# Altium schematic sheet 0186.SchDoc
size 848 x 558 mm
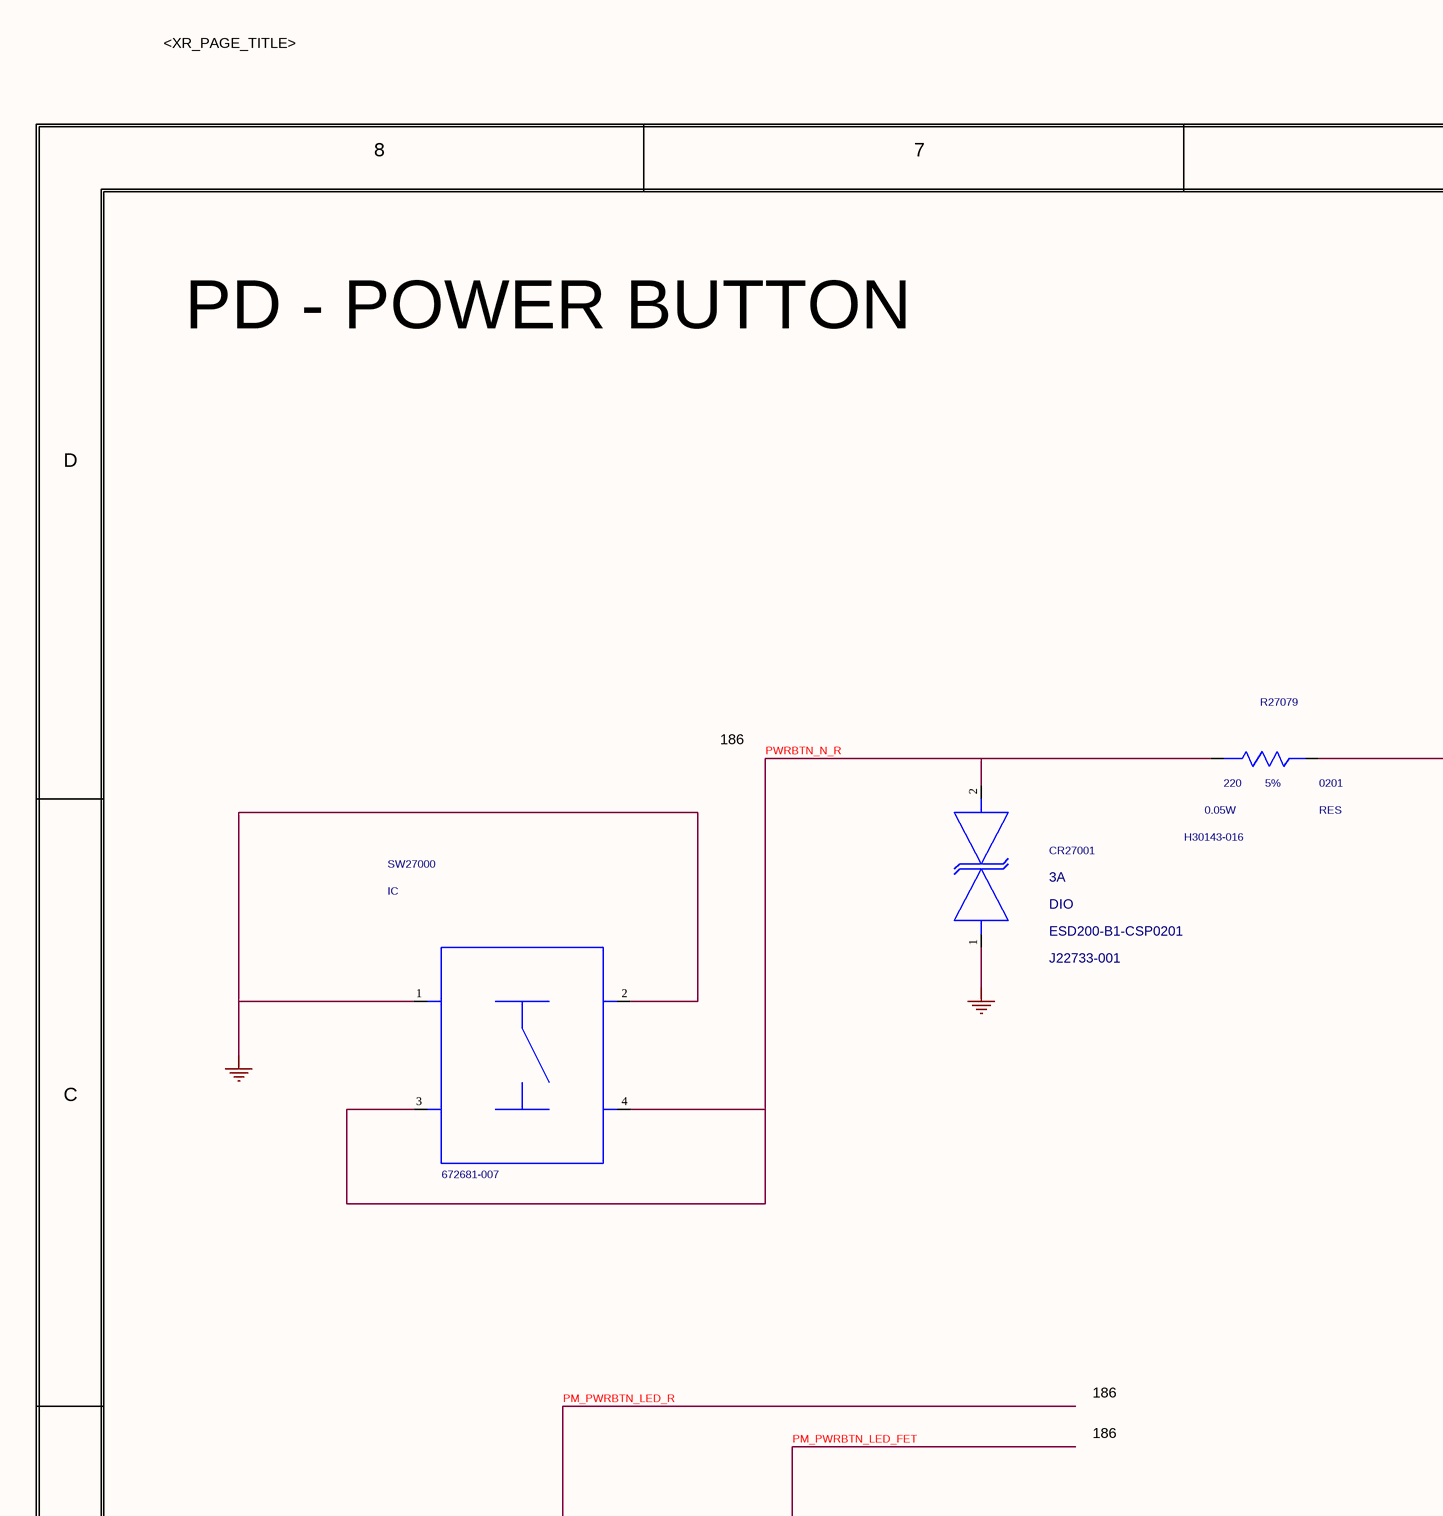
[diagram p0: 0186.SchDoc, top left]
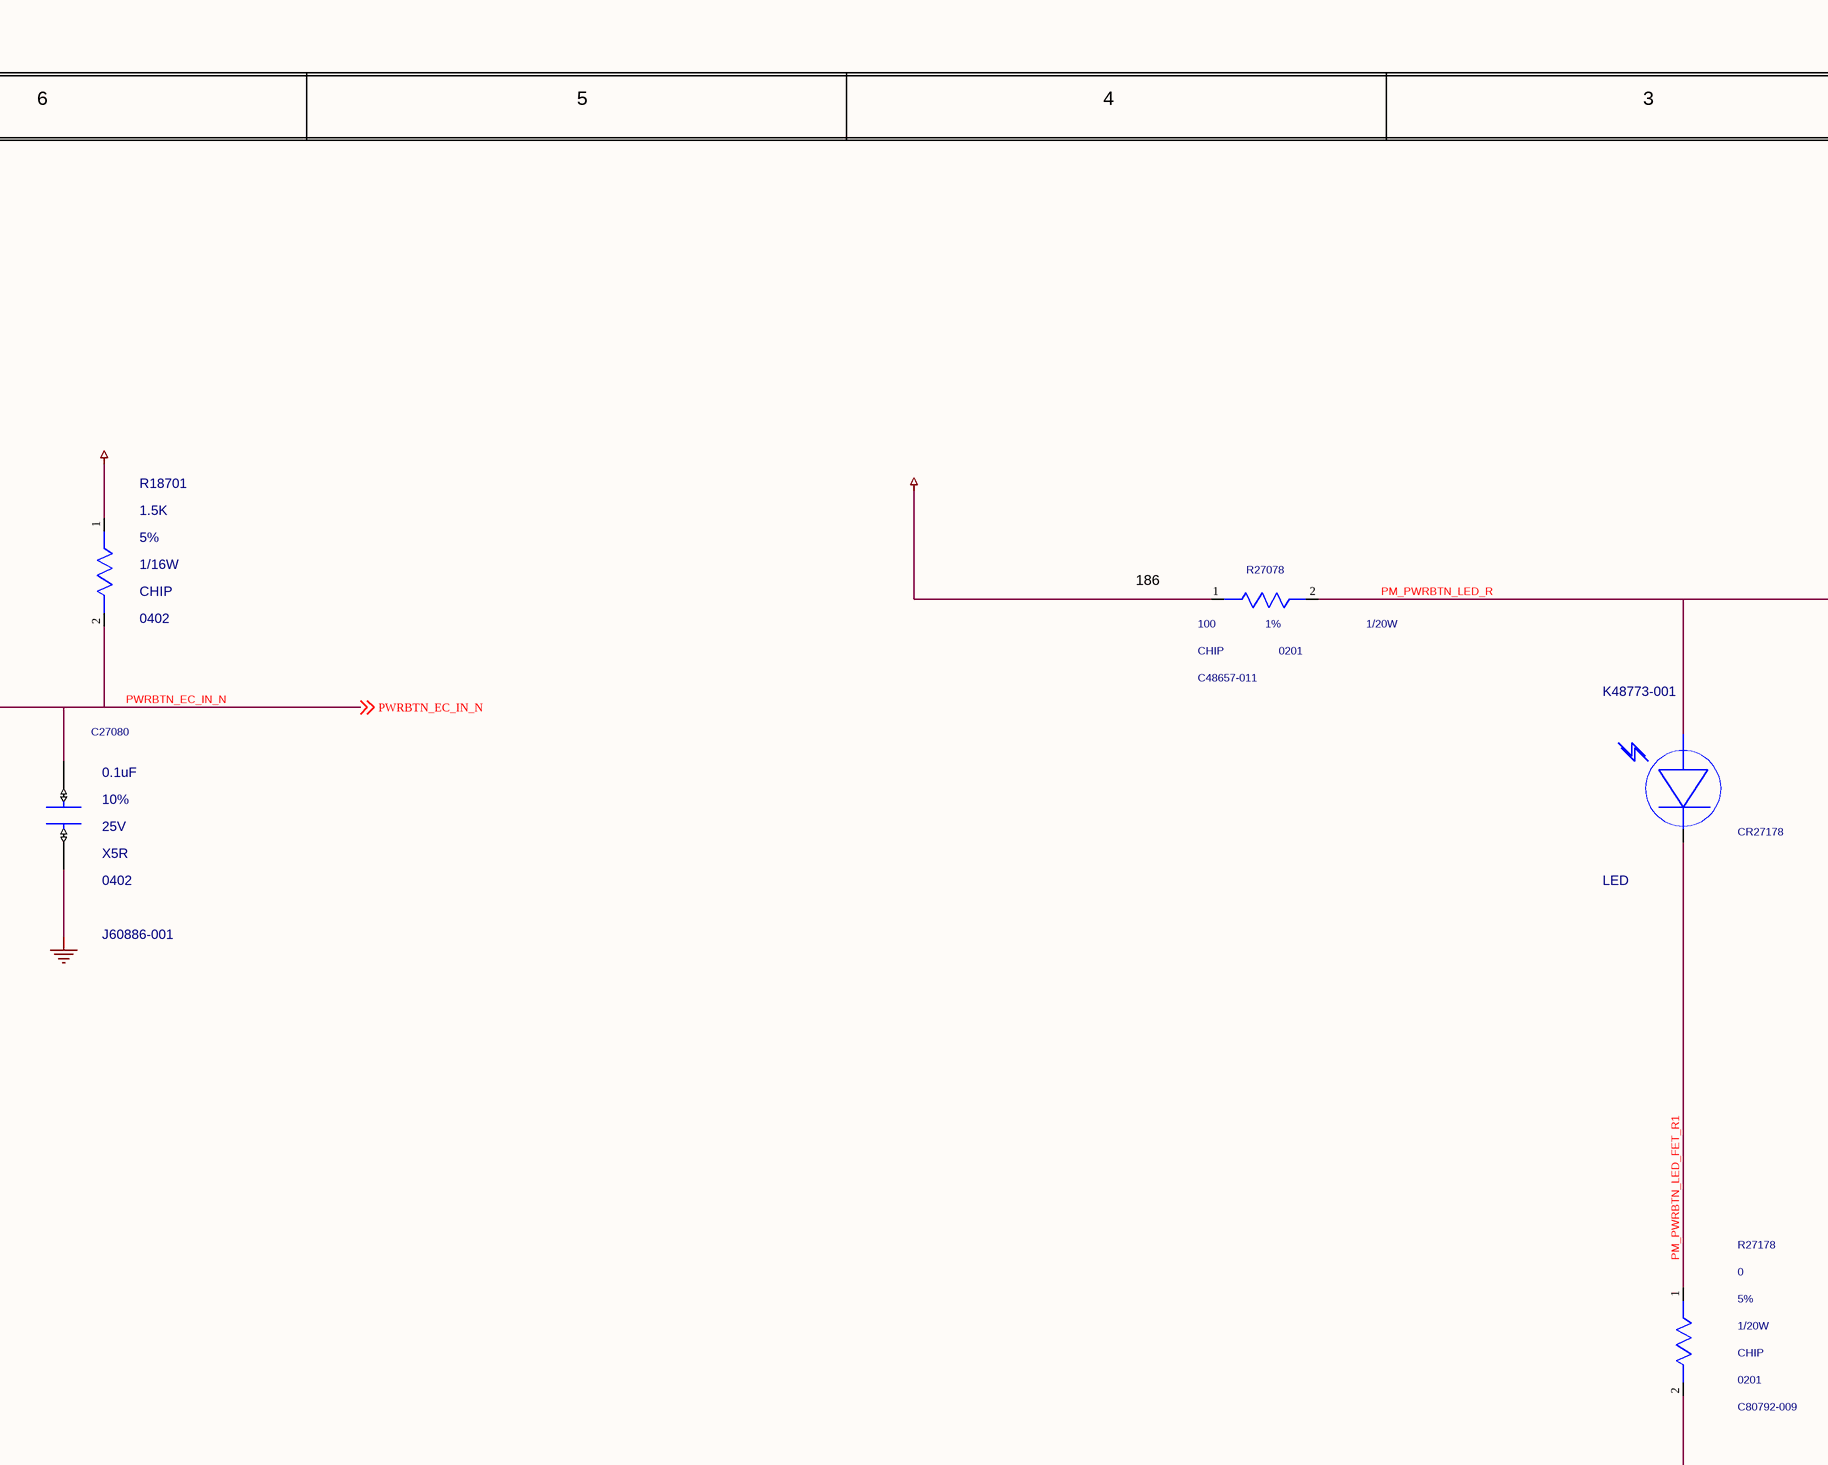
[diagram p1: 0186.SchDoc, top middle]
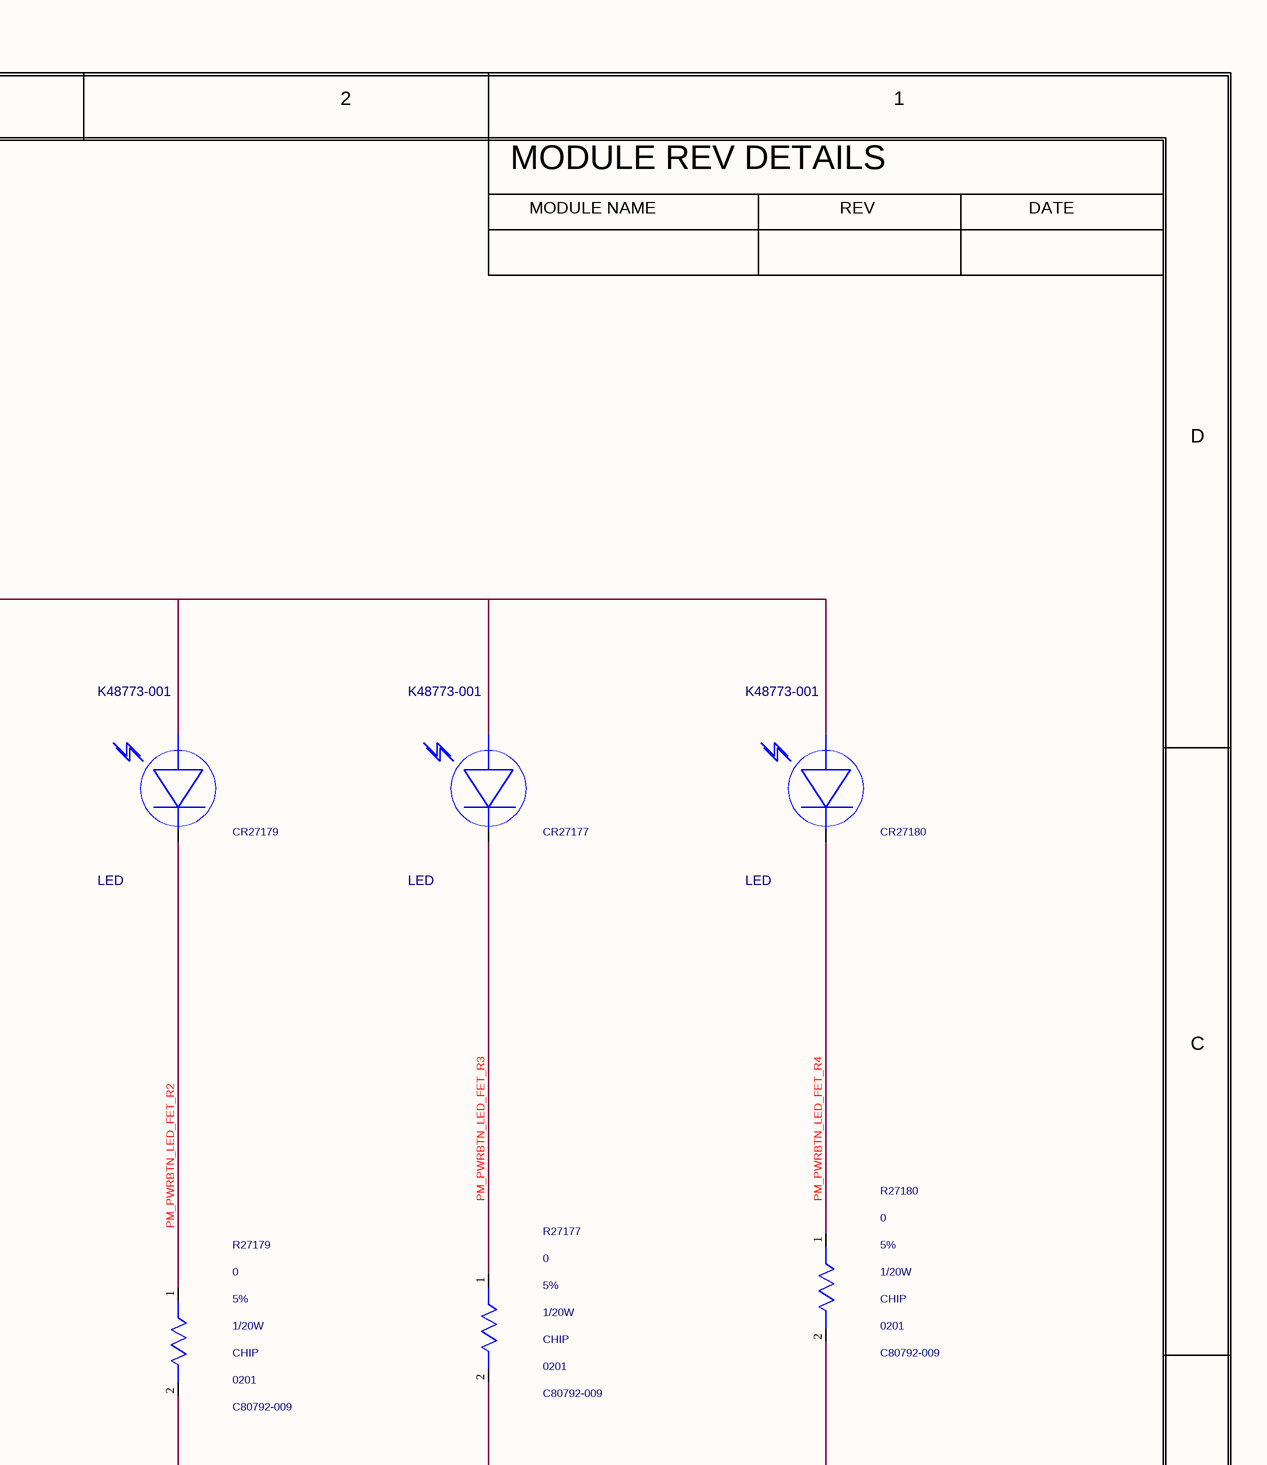
[diagram p2: 0186.SchDoc, top right]
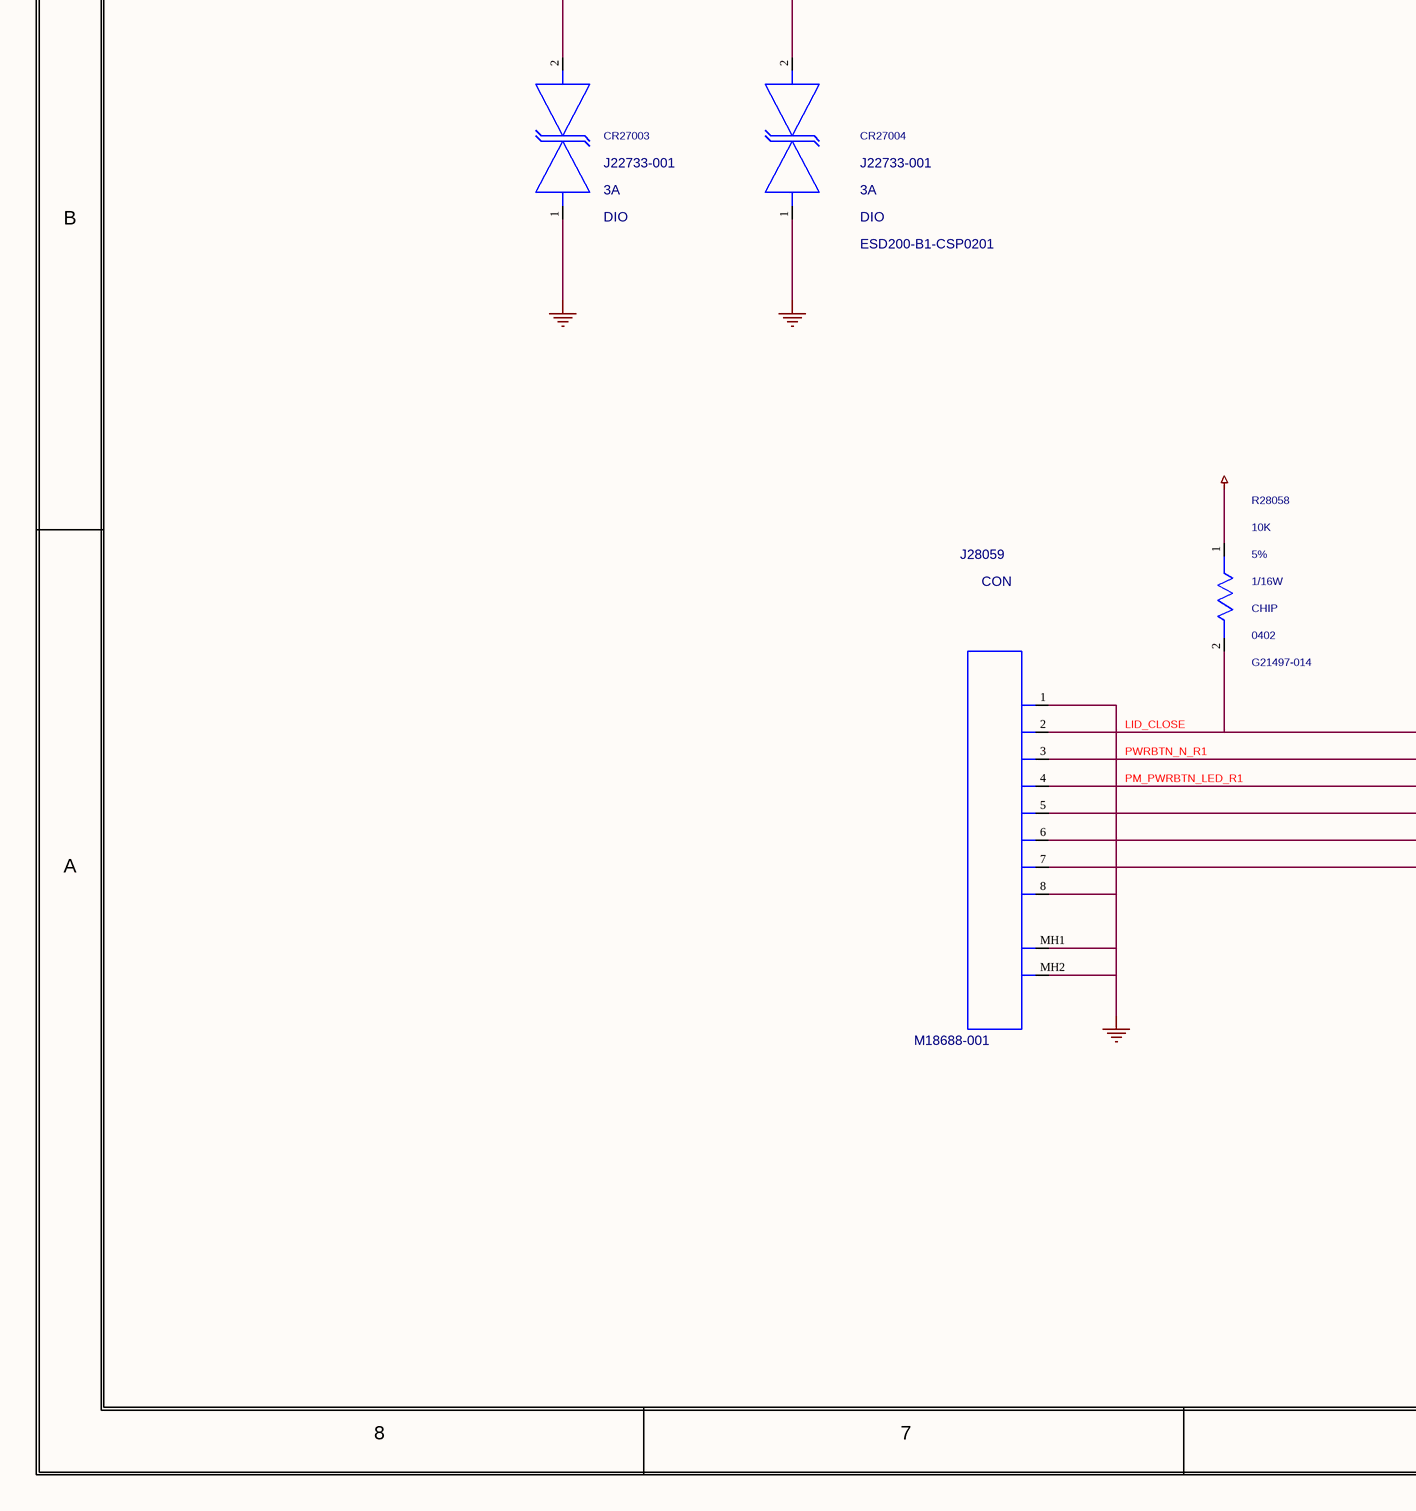
[diagram p3: 0186.SchDoc, bottom left]
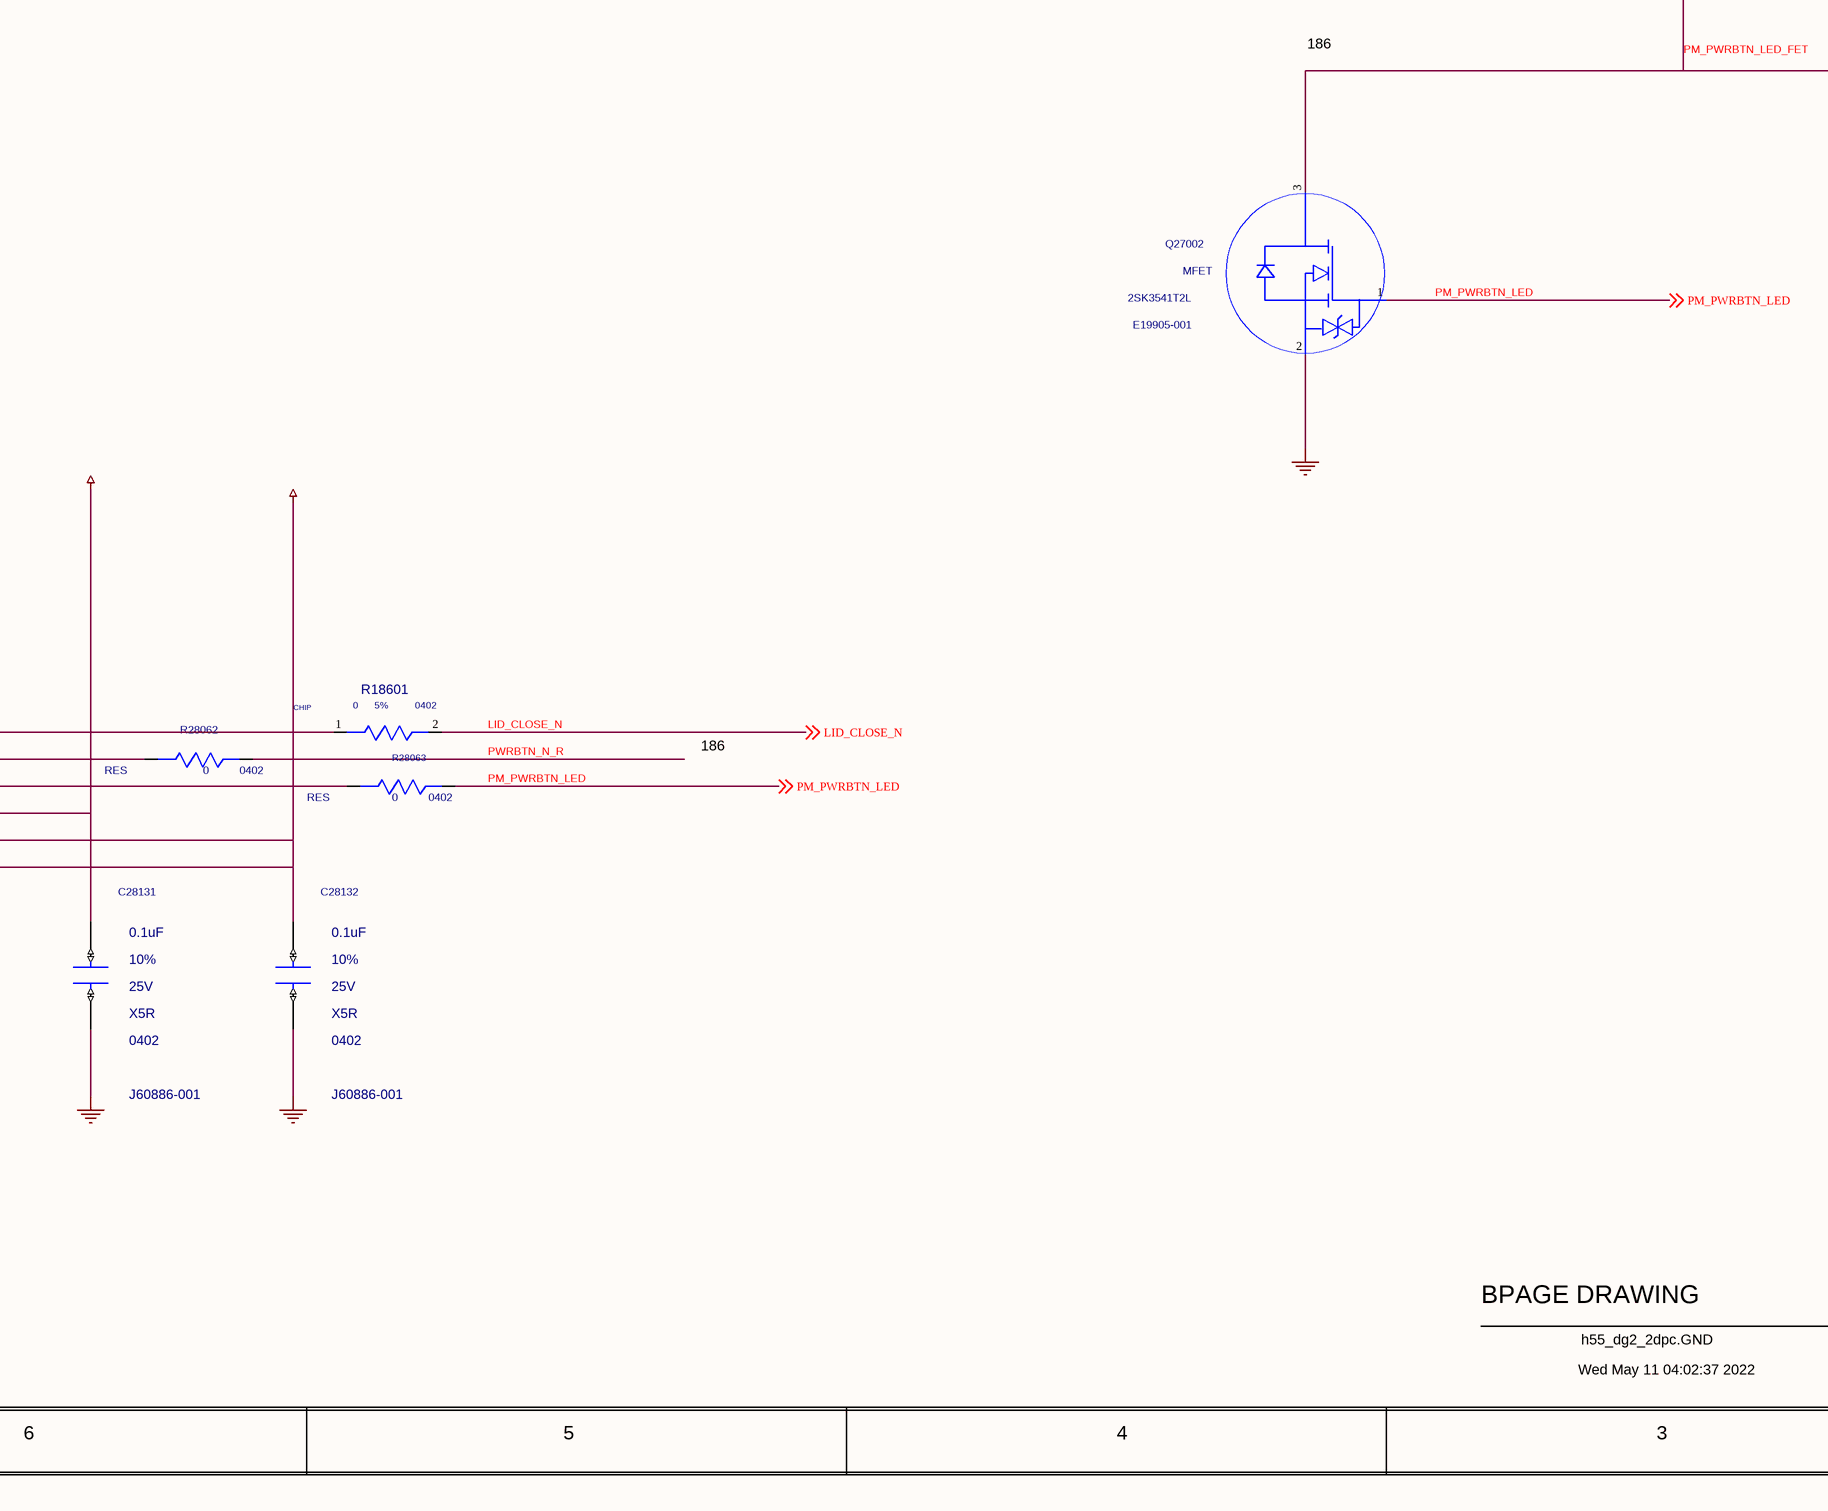
[diagram p4: 0186.SchDoc, bottom middle]
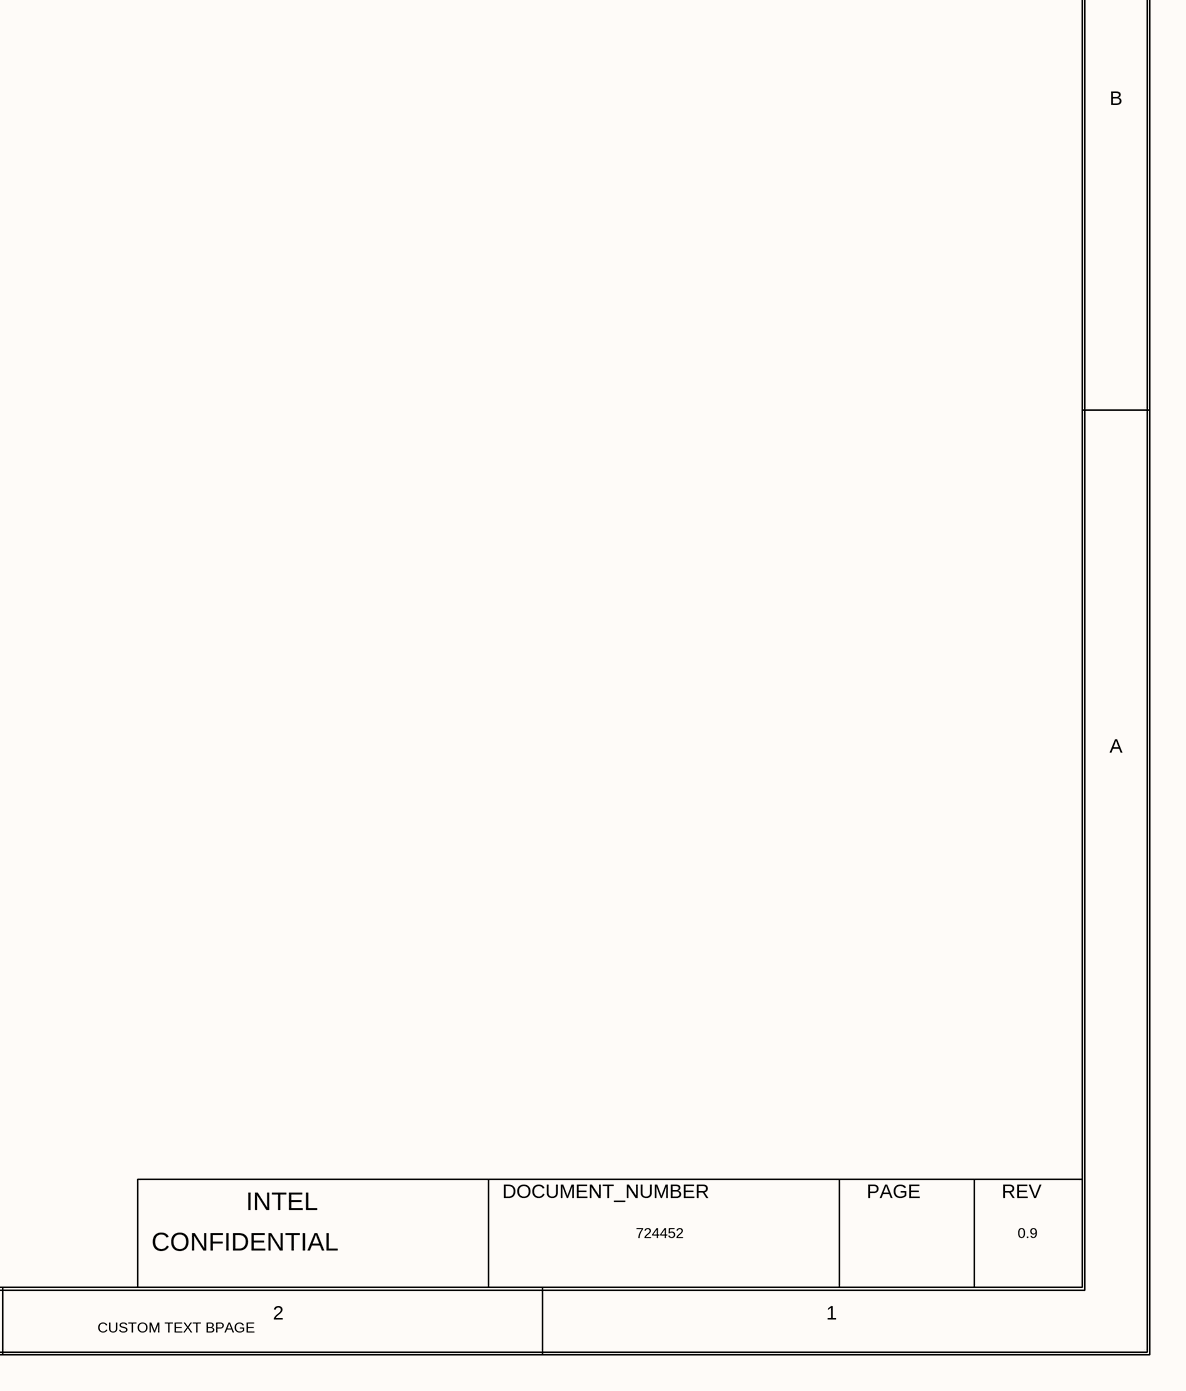
[diagram p5: 0186.SchDoc, bottom right]

## Parts
C27080  0.1uF  MATERIAL: X5R  PACK_TYPE: 0402  PART_NUMBER: J60886-001  TOLERANCE: 10%  VOLTAGE: 25V  [TK0_SM0402_1050X550_MB]
C28131  0.1uF  MATERIAL: X5R  PACK_TYPE: 0402  PART_NUMBER: J60886-001  TOLERANCE: 10%  VOLTAGE: 25V  [TK0_SM0402_1050X550_MB]
C28132  0.1uF  MATERIAL: X5R  PACK_TYPE: 0402  PART_NUMBER: J60886-001  TOLERANCE: 10%  VOLTAGE: 25V  [TK0_SM0402_1050X550_MB]
CR27001  ESD200-B1-CSP0201  CURRENT: 3A  MATERIAL: DIO  PART_NUMBER: J22733-001  [TK1_SCR0201_610X310_MB]
CR27003  CURRENT: 3A  MATERIAL: DIO  PART_NUMBER: J22733-001  [TK1_SCR0201_610X310_MB]  (hidden comment: ESD200-B1-CSP0201)
CR27004  ESD200-B1-CSP0201  CURRENT: 3A  MATERIAL: DIO  PART_NUMBER: J22733-001  [TK1_SCR0201_610X310_MB]
CR27177  MATERIAL: LED  PART_NUMBER: K48773-001  [TK2_SLED0402_1100X600_MA]  (hidden comment: LED_2)
CR27178  MATERIAL: LED  PART_NUMBER: K48773-001  [TK2_SLED0402_1100X600_MA]  (hidden comment: LED_2)
CR27179  MATERIAL: LED  PART_NUMBER: K48773-001  [TK2_SLED0402_1100X600_MA]  (hidden comment: LED_2)
CR27180  MATERIAL: LED  PART_NUMBER: K48773-001  [TK2_SLED0402_1100X600_MA]  (hidden comment: LED_2)
J28059  MATERIAL: CON  PART_NUMBER: M18688-001  [CTK0_B2B_SJR_1X8_2EM_500_MA_VR]  (hidden comment: C_B2B_1X8_2EM)
Q27002  2SK3541T2L  MATERIAL: MFET  PART_NUMBER: E19905-001  [CTK0_SOT723_900X1300_400_MA]
R18601  0  MATERIAL: CHIP  PACK_TYPE: 0402  TOLERANCE: 5%  [SMR0402IA]
R18701  1.5K  MATERIAL: CHIP  PACK_TYPE: 0402  TOLERANCE: 5%  WATTAGE: 1/16W  [SMR0402IA]
R27078  100  MATERIAL: CHIP  PACK_TYPE: 0201  PART_NUMBER: C48657-011  TOLERANCE: 1%  WATTAGE: 1/20W  [SMR0201IA]
R27079  220  MATERIAL: RES  PACK_TYPE: 0201  PART_NUMBER: H30143-016  TOLERANCE: 5%  WATTAGE: 0.05W  [CTK0_SM0201_630X330_MA]
R27177  0  MATERIAL: CHIP  PACK_TYPE: 0201  PART_NUMBER: C80792-009  TOLERANCE: 5%  WATTAGE: 1/20W  [SMR0201IA]
R27178  0  MATERIAL: CHIP  PACK_TYPE: 0201  PART_NUMBER: C80792-009  TOLERANCE: 5%  WATTAGE: 1/20W  [SMR0201IA]
R27179  0  MATERIAL: CHIP  PACK_TYPE: 0201  PART_NUMBER: C80792-009  TOLERANCE: 5%  WATTAGE: 1/20W  [SMR0201IA]
R27180  0  MATERIAL: CHIP  PACK_TYPE: 0201  PART_NUMBER: C80792-009  TOLERANCE: 5%  WATTAGE: 1/20W  [SMR0201IA]
R28058  10K  MATERIAL: CHIP  PACK_TYPE: 0402  PART_NUMBER: G21497-014  TOLERANCE: 5%  WATTAGE: 1/16W  [SMR0402IA]
R28062  0  MATERIAL: RES  PACK_TYPE: 0402  [CTK0_SM0402_1100X550_MA]
R28063  0  MATERIAL: RES  PACK_TYPE: 0402  [CTK0_SM0402_1100X550_MA]
SW27000  MATERIAL: IC  PART_NUMBER: 672681-007  [CTK0_SSW4_VPS5200_3700_MA_VR]  (hidden comment: C_SW_SPST_PB_4P)

## Nets
+V3P3A_KBC: C28131.1(A) J28059.5(IO5) R27078.1(A)
+V5A_L: C28132.1(A) J28059.6(IO6) J28059.7(IO7)
+V_EC_VBAT: R18701.1(A)
+VREG3P3_DSW: R28058.1(A)
GND: C27080.2(B) C28131.2(B) C28132.2(B) CR27001.1(A1) CR27003.1(A1) CR27004.1(A1) J28059.1(IO1) J28059.8(IO8) J28059.MH1 J28059.MH2 Q27002.2(S) SW27000.1 SW27000.2
LID_CLOSE: J28059.2(IO2) R18601.1(A) R28058.2(B)
LID_CLOSE_N: R18601.2(B) ; off-sheet LID_CLOSE_N
PM_PWRBTN_LED: Q27002.1(G) R28063.2(B) ; off-sheet PM_PWRBTN_LED
PM_PWRBTN_LED_FET: CR27004.2(A2) Q27002.3(D) R27177.2(B) R27178.2(B) R27179.2(B) R27180.2(B)
PM_PWRBTN_LED_FET_R1: CR27178.2(C) R27178.1(A)
PM_PWRBTN_LED_FET_R2: CR27179.2(C) R27179.1(A)
PM_PWRBTN_LED_FET_R3: CR27177.2(C) R27177.1(A)
PM_PWRBTN_LED_FET_R4: CR27180.2(C) R27180.1(A)
PM_PWRBTN_LED_R: CR27003.2(A2) CR27177.1(A) CR27178.1(A) CR27179.1(A) CR27180.1(A) R27078.2(B)
PM_PWRBTN_LED_R1: J28059.4(IO4) R28063.1(A)
PWRBTN_EC_IN_N: C27080.1(A) R18701.2(B) R27079.2(B) ; off-sheet PWRBTN_EC_IN_N
PWRBTN_N_R: CR27001.2(A2) R27079.1(A) R28062.2(B) SW27000.3 SW27000.4
PWRBTN_N_R1: J28059.3(IO3) R28062.1(A)

## Notes on the sheet
- <XR_PAGE_TITLE>
- 8
- 7
- 6
- 5
- 4
- 3
- 2
- 1
- MODULE REV DETAILS
- MODULE NAME
- REV
- DATE
- PD - POWER BUTTON
- D
- 186
- C
- B
- A
- BPAGE DRAWING
- INTEL
- DOCUMENT_NUMBER
- PAGE
- Wed May 11 04:02:37 2022
- h55_dg2_2dpc.GND
- CONFIDENTIAL
- 724452
- 0.9
- CUSTOM TEXT BPAGE

## Library data of the parts
C27080 = CAP_2: CDS_PHYS_PART_NAME: CAP_2_0402-J60886-001,X5R,0.1UF,25V,10%,TK0,GENERIC; BOM_USE: STUFF; CDS_LMAN_SYM_OUTLINE: -50,50,50,-50; FP_TECH: TK0; IP: GENERIC; ROOM: NONE; OriginalSymbolOrigin: (-50,25); XY: (-8850,1075); VER: 1; SUB_ROOM_2: MISC; SUB_ROOM_1: BUTTONS; SUB_ROOM: DECOUPLING; ROT: 0; PHYS_PAGE: 186; LOCATION: C27080; DRAWING: @RVP1_ADL_SB_ADP_S_DDR5_SODIMM_2DPC_LIB.H55_DG2_2DPC(SCH_1):PAGE555; CDS_LIB: discrete_2; VARIANT: ?; PCB Footprint: TK0_SM0402_1050X550_MB; CHIPS_PART_NAME: CAP_2; CDS_PART_NAME: CAP_2_0402-J60886-001,X5R,0.1UF,25V,10%,TK0,GENERIC; CDS_LOCATION: C27080
C28131 = CAP_2: CDS_PHYS_PART_NAME: CAP_2_0402-J60886-001,X5R,0.1UF,25V,10%,TK0,GENERIC; BOM_USE: STUFF; CDS_LMAN_SYM_OUTLINE: -50,50,50,-50; FP_TECH: TK0; IP: GENERIC; ROOM: NONE; OriginalSymbolOrigin: (-50,25); XY: (-8800,-1875); VER: 1; SUB_ROOM_2: MISC; SUB_ROOM_1: BUTTONS; SUB_ROOM: DECOUPLING; ROT: 0; PHYS_PAGE: 186; LOCATION: C28131; DRAWING: @RVP1_ADL_SB_ADP_S_DDR5_SODIMM_2DPC_LIB.H55_DG2_2DPC(SCH_1):PAGE555; CDS_LIB: discrete_2; VARIANT: ?; PCB Footprint: TK0_SM0402_1050X550_MB; CHIPS_PART_NAME: CAP_2; CDS_PART_NAME: CAP_2_0402-J60886-001,X5R,0.1UF,25V,10%,TK0,GENERIC; CDS_LOCATION: C28131
C28132 = CAP_2: CDS_PHYS_PART_NAME: CAP_2_0402-J60886-001,X5R,0.1UF,25V,10%,TK0,GENERIC; BOM_USE: STUFF; CDS_LMAN_SYM_OUTLINE: -50,50,50,-50; FP_TECH: TK0; IP: GENERIC; ROOM: NONE; OriginalSymbolOrigin: (-50,25); XY: (-8425,-1875); VER: 1; SUB_ROOM_2: MISC; SUB_ROOM_1: BUTTONS; SUB_ROOM: DECOUPLING; ROT: 0; PHYS_PAGE: 186; LOCATION: C28132; DRAWING: @RVP1_ADL_SB_ADP_S_DDR5_SODIMM_2DPC_LIB.H55_DG2_2DPC(SCH_1):PAGE555; CDS_LIB: discrete_2; VARIANT: ?; PCB Footprint: TK0_SM0402_1050X550_MB; CHIPS_PART_NAME: CAP_2; CDS_PART_NAME: CAP_2_0402-J60886-001,X5R,0.1UF,25V,10%,TK0,GENERIC; CDS_LOCATION: C28132
CR27001 = DIODE_TVS_2: CDS_PHYS_PART_NAME: DIODE_TVS_2_SM-J22733-001,DIO,ESD200-B1-CSP0201,3A,TK1,GENERIC; BOM_USE: STUFF; CDS_LMAN_SYM_OUTLINE: -100,50,100,-50; FP_TECH: TK1; IP: GENERIC; PACK_TYPE: SM; ROOM: NONE; OriginalSymbolOrigin: (-125,50); XY: (-9775,1075); VER: 1; SUB_ROOM_2: EMI_ESD_FILTER; SUB_ROOM_1: BUTTONS; SUB_ROOM: ESD; PHYS_PAGE: 186; LOCATION: CR27001; DRAWING: @RVP1_ADL_SB_ADP_S_DDR5_SODIMM_2DPC_LIB.H55_DG2_2DPC(SCH_1):PAGE555; CDS_LIB: discrete_2; VARIANT: ?; PCB Footprint: TK1_SCR0201_610X310_MB; ROT: 1; CHIPS_PART_NAME: DIODE_TVS_2; CDS_PART_NAME: DIODE_TVS_2_SM-J22733-001,DIO,ESD200-B1-CSP0201,3A,TK1,GENERIC; CDS_LOCATION: CR27001
CR27003 = DIODE_TVS_2: CDS_PHYS_PART_NAME: DIODE_TVS_2_SM-J22733-001,DIO,ESD200-B1-CSP0201,3A,TK1,GENERIC; BOM_USE: STUFF; CDS_LMAN_SYM_OUTLINE: -100,50,100,-50; FP_TECH: TK1; IP: GENERIC; PACK_TYPE: SM; ROOM: NONE; OriginalSymbolOrigin: (-125,50); XY: (-10550,-325); VER: 1; SUB_ROOM_2: EMI_ESD_FILTER; SUB_ROOM_1: BUTTONS; SUB_ROOM: ESD; ROT: 7; PHYS_PAGE: 186; LOCATION: CR27003; DRAWING: @RVP1_ADL_SB_ADP_S_DDR5_SODIMM_2DPC_LIB.H55_DG2_2DPC(SCH_1):PAGE555; CDS_LIB: discrete_2; VARIANT: ?; PCB Footprint: TK1_SCR0201_610X310_MB; CHIPS_PART_NAME: DIODE_TVS_2; CDS_PART_NAME: DIODE_TVS_2_SM-J22733-001,DIO,ESD200-B1-CSP0201,3A,TK1,GENERIC; CDS_LOCATION: CR27003
CR27004 = DIODE_TVS_2: CDS_PHYS_PART_NAME: DIODE_TVS_2_SM-J22733-001,DIO,ESD200-B1-CSP0201,3A,TK1,GENERIC; BOM_USE: STUFF; CDS_LMAN_SYM_OUTLINE: -100,50,100,-50; FP_TECH: TK1; IP: GENERIC; PACK_TYPE: SM; ROOM: NONE; OriginalSymbolOrigin: (-125,50); XY: (-10125,-325); VER: 1; SUB_ROOM_2: EMI_ESD_FILTER; SUB_ROOM_1: BUTTONS; SUB_ROOM: ESD; ROT: 7; PHYS_PAGE: 186; LOCATION: CR27004; DRAWING: @RVP1_ADL_SB_ADP_S_DDR5_SODIMM_2DPC_LIB.H55_DG2_2DPC(SCH_1):PAGE555; CDS_LIB: discrete_2; VARIANT: ?; PCB Footprint: TK1_SCR0201_610X310_MB; CHIPS_PART_NAME: DIODE_TVS_2; CDS_PART_NAME: DIODE_TVS_2_SM-J22733-001,DIO,ESD200-B1-CSP0201,3A,TK1,GENERIC; CDS_LOCATION: CR27004
CR27177 = LED_2: CDS_PHYS_PART_NAME: LED_2_A1-K48773-001,LED,WHITE,TK2,GENERIC; BOM_USE: STUFF; CDS_LMAN_SYM_OUTLINE: -150,100,100,-100; FP_TECH: TK2; IP: GENERIC; PACK_TYPE: A1; ROOM: NONE; OriginalSymbolOrigin: (-125,75); XY: (-4650,1125); VER: 4; ROT: 6; PHYS_PAGE: 186; LOCATION: CR27177; DRAWING: @RVP1_ADL_SB_ADP_S_DDR5_SODIMM_2DPC_LIB.H55_DG2_2DPC(SCH_1):PAGE555; CDS_LIB: discrete_2; VARIANT: ?; PCB Footprint: TK2_SLED0402_1100X600_MA; CHIPS_PART_NAME: LED_2; CDS_PART_NAME: LED_2_A1-K48773-001,LED,WHITE,TK2,GENERIC; CDS_LOCATION: CR27177
CR27178 = LED_2: CDS_PHYS_PART_NAME: LED_2_A1-K48773-001,LED,WHITE,TK2,GENERIC; BOM_USE: STUFF; CDS_LMAN_SYM_OUTLINE: -150,100,100,-100; FP_TECH: TK2; IP: GENERIC; PACK_TYPE: A1; ROOM: NONE; OriginalSymbolOrigin: (-125,75); XY: (-5850,1125); VER: 4; ROT: 6; PHYS_PAGE: 186; LOCATION: CR27178; DRAWING: @RVP1_ADL_SB_ADP_S_DDR5_SODIMM_2DPC_LIB.H55_DG2_2DPC(SCH_1):PAGE555; CDS_LIB: discrete_2; VARIANT: ?; PCB Footprint: TK2_SLED0402_1100X600_MA; CHIPS_PART_NAME: LED_2; CDS_PART_NAME: LED_2_A1-K48773-001,LED,WHITE,TK2,GENERIC; CDS_LOCATION: CR27178
CR27179 = LED_2: CDS_PHYS_PART_NAME: LED_2_A1-K48773-001,LED,WHITE,TK2,GENERIC; BOM_USE: STUFF; CDS_LMAN_SYM_OUTLINE: -150,100,100,-100; FP_TECH: TK2; IP: GENERIC; PACK_TYPE: A1; ROOM: NONE; OriginalSymbolOrigin: (-125,75); XY: (-5225,1125); VER: 4; ROT: 6; PHYS_PAGE: 186; LOCATION: CR27179; DRAWING: @RVP1_ADL_SB_ADP_S_DDR5_SODIMM_2DPC_LIB.H55_DG2_2DPC(SCH_1):PAGE555; CDS_LIB: discrete_2; VARIANT: ?; PCB Footprint: TK2_SLED0402_1100X600_MA; CHIPS_PART_NAME: LED_2; CDS_PART_NAME: LED_2_A1-K48773-001,LED,WHITE,TK2,GENERIC; CDS_LOCATION: CR27179
CR27180 = LED_2: CDS_PHYS_PART_NAME: LED_2_A1-K48773-001,LED,WHITE,TK2,GENERIC; BOM_USE: STUFF; CDS_LMAN_SYM_OUTLINE: -150,100,100,-100; FP_TECH: TK2; IP: GENERIC; PACK_TYPE: A1; ROOM: NONE; OriginalSymbolOrigin: (-125,75); XY: (-4025,1125); VER: 4; ROT: 6; PHYS_PAGE: 186; LOCATION: CR27180; DRAWING: @RVP1_ADL_SB_ADP_S_DDR5_SODIMM_2DPC_LIB.H55_DG2_2DPC(SCH_1):PAGE555; CDS_LIB: discrete_2; VARIANT: ?; PCB Footprint: TK2_SLED0402_1100X600_MA; CHIPS_PART_NAME: LED_2; CDS_PART_NAME: LED_2_A1-K48773-001,LED,WHITE,TK2,GENERIC; CDS_LOCATION: CR27180
J28059 = C_B2B_1X8_2EM#1: CDS_PHYS_PART_NAME: C_B2B_1X8_2EM_SM-M18688-001,CON,C_B2B_1X8_2EM,TK0,GENERIC; CDS_LMAN_SYM_OUTLINE: -50,350,50,-350; FP_TECH: TK0; IP: GENERIC; PACK_TYPE: SM; ROOM: NONE; OriginalSymbolOrigin: (-75,350); XY: (-9750,-1625); VER: 2; PHYS_PAGE: 186; LOCATION: J28059; DRAWING: @RVP1_ADL_SB_ADP_S_DDR5_SODIMM_2DPC_LIB.H55_DG2_2DPC(SCH_1):PAGE555; CDS_LIB: local; VARIANT: ?; PCB Footprint: CTK0_B2B_SJR_1X8_2EM_500_MA_VR; ROT: 2; CHIPS_PART_NAME: C_B2B_1X8_2EM; CDS_PART_NAME: C_B2B_1X8_2EM_SM-M18688-001,CON,C_B2B_1X8_2EM,TK0,GENERIC; CDS_LOCATION: J28059
Q27002 = C_MOSFET_N_ESD: CDS_PHYS_PART_NAME: C_MOSFET_N_ESD_SOT723-E19905-001,MFET,2SK3541T2L,TK0,GENERIC; CDS_LMAN_SYM_OUTLINE: -150,150,150,-150; FP_TECH: TK0; IP: GENERIC; PACK_TYPE: SOT723; ROOM: NONE; OriginalSymbolOrigin: (-150,150); XY: (-6550,-575); VER: 1; ROT: 2; PHYS_PAGE: 186; LOCATION: Q27002; DRAWING: @RVP1_ADL_SB_ADP_S_DDR5_SODIMM_2DPC_LIB.H55_DG2_2DPC(SCH_1):PAGE555; CDS_LIB: local; VARIANT: ?; PCB Footprint: CTK0_SOT723_900X1300_400_MA; SEC_TYPE: SOT723; CHIPS_PART_NAME: C_MOSFET_N_ESD; CDS_PART_NAME: C_MOSFET_N_ESD_SOT723-E19905-001,MFET,2SK3541T2L,TK0,GENERIC; CDS_LOCATION: Q27002
R18601 = RES#1: PART_NUMBER: A93549-001; CHIPS_PART_NAME: RES; CDS_PHYS_PART_NAME: RES_0402-A93549-001,CHIP,0,5%,1/16W,LPDB,GENERIC; WATTAGE: 1/16W; OriginalSymbolOrigin: (-75,25); XY: (-8250,-1425); VER: 1; PHYS_PAGE: 186; LOCATION: R18601; IP: GENERIC; FP_TECH: LPDB; DRAWING: @RVP1_ADL_SB_ADP_S_DDR5_SODIMM_2DPC_LIB.H55_DG2_2DPC(SCH_1):PAGE555; CDS_LIB: discrete; PCB Footprint: SMR0402IA; ROT: 0; CDS_PART_NAME: RES_0402-A93549-001,CHIP,0,5%,1/16W,LPDB,GENERIC; CDS_LOCATION: R18601; ASI_MODEL: A93549-001
R18701 = RES: PART_NUMBER: A36093-041; CDS_PHYS_PART_NAME: RES_0402-A36093-041,CHIP,1.5K,5%,1/16W,LPDB,GENERIC; OriginalSymbolOrigin: (-25,75); XY: (-8775,1525); VER: 2; ROT: 0; PHYS_PAGE: 186; LOCATION: R18701; IP: GENERIC; FP_TECH: LPDB; DRAWING: @RVP1_ADL_SB_ADP_S_DDR5_SODIMM_2DPC_LIB.H55_DG2_2DPC(SCH_1):PAGE555; CDS_LIB: discrete; PCB Footprint: SMR0402IA; CHIPS_PART_NAME: RES; CDS_PART_NAME: RES_0402-A36093-041,CHIP,1.5K,5%,1/16W,LPDB,GENERIC; CDS_LOCATION: R18701
R27078 = RES#1: CHIPS_PART_NAME: RES; CDS_PHYS_PART_NAME: RES_0201-C48657-011,CHIP,100,1%,1/20W,LPDB,GENERIC; OriginalSymbolOrigin: (-75,25); XY: (-6625,1475); VER: 1; SUB_ROOM_2: MISC; SUB_ROOM_1: BUTTONS; SUB_ROOM: PUPD; ROT: 0; PHYS_PAGE: 186; LOCATION: R27078; IP: GENERIC; FP_TECH: LPDB; DRAWING: @RVP1_ADL_SB_ADP_S_DDR5_SODIMM_2DPC_LIB.H55_DG2_2DPC(SCH_1):PAGE555; CDS_LIB: discrete; PCB Footprint: SMR0201IA; CDS_PART_NAME: RES_0201-C48657-011,CHIP,100,1%,1/20W,LPDB,GENERIC; CDS_LOCATION: R27078
R27079 = C_RES#1: CHIPS_PART_NAME: C_RES; CDS_PHYS_PART_NAME: C_RES_0201-H30143-016,RES,220,5%,0.05W,TK0,GENERIC; CDS_LMAN_SYM_OUTLINE: -50,50,50,-50; FP_TECH: TK0; IP: GENERIC; ROOM: NONE; OriginalSymbolOrigin: (-75,25); XY: (-9250,1275); VER: 1; ROT: 0; PHYS_PAGE: 186; LOCATION: R27079; DRAWING: @RVP1_ADL_SB_ADP_S_DDR5_SODIMM_2DPC_LIB.H55_DG2_2DPC(SCH_1):PAGE555; CDS_LIB: c_discrete; VARIANT: ?; PCB Footprint: CTK0_SM0201_630X330_MA; SEC_TYPE: 0201; CDS_PART_NAME: C_RES_0201-H30143-016,RES,220,5%,0.05W,TK0,GENERIC; CDS_LOCATION: R27079
R27177 = RES: CDS_PHYS_PART_NAME: RES_0201-C80792-009,CHIP,0,5%,1/20W,LPDB,GENERIC; OriginalSymbolOrigin: (-25,75); XY: (-4650,125); VER: 2; PHYS_PAGE: 186; LOCATION: R27177; IP: GENERIC; FP_TECH: LPDB; DRAWING: @RVP1_ADL_SB_ADP_S_DDR5_SODIMM_2DPC_LIB.H55_DG2_2DPC(SCH_1):PAGE555; CDS_LIB: discrete; PCB Footprint: SMR0201IA; SEC_TYPE: 0201; ROT: 0; CHIPS_PART_NAME: RES; CDS_PART_NAME: RES_0201-C80792-009,CHIP,0,5%,1/20W,LPDB,GENERIC; CDS_LOCATION: R27177
R27178 = RES: CDS_PHYS_PART_NAME: RES_0201-C80792-009,CHIP,0,5%,1/20W,LPDB,GENERIC; OriginalSymbolOrigin: (-25,75); XY: (-5850,100); VER: 2; PHYS_PAGE: 186; LOCATION: R27178; IP: GENERIC; FP_TECH: LPDB; DRAWING: @RVP1_ADL_SB_ADP_S_DDR5_SODIMM_2DPC_LIB.H55_DG2_2DPC(SCH_1):PAGE555; CDS_LIB: discrete; PCB Footprint: SMR0201IA; SEC_TYPE: 0201; ROT: 0; CHIPS_PART_NAME: RES; CDS_PART_NAME: RES_0201-C80792-009,CHIP,0,5%,1/20W,LPDB,GENERIC; CDS_LOCATION: R27178
R27179 = RES: CDS_PHYS_PART_NAME: RES_0201-C80792-009,CHIP,0,5%,1/20W,LPDB,GENERIC; OriginalSymbolOrigin: (-25,75); XY: (-5225,100); VER: 2; PHYS_PAGE: 186; LOCATION: R27179; IP: GENERIC; FP_TECH: LPDB; DRAWING: @RVP1_ADL_SB_ADP_S_DDR5_SODIMM_2DPC_LIB.H55_DG2_2DPC(SCH_1):PAGE555; CDS_LIB: discrete; PCB Footprint: SMR0201IA; SEC_TYPE: 0201; ROT: 0; CHIPS_PART_NAME: RES; CDS_PART_NAME: RES_0201-C80792-009,CHIP,0,5%,1/20W,LPDB,GENERIC; CDS_LOCATION: R27179
R27180 = RES: CDS_PHYS_PART_NAME: RES_0201-C80792-009,CHIP,0,5%,1/20W,LPDB,GENERIC; OriginalSymbolOrigin: (-25,75); XY: (-4025,200); VER: 2; PHYS_PAGE: 186; LOCATION: R27180; IP: GENERIC; FP_TECH: LPDB; DRAWING: @RVP1_ADL_SB_ADP_S_DDR5_SODIMM_2DPC_LIB.H55_DG2_2DPC(SCH_1):PAGE555; CDS_LIB: discrete; PCB Footprint: SMR0201IA; SEC_TYPE: 0201; ROT: 0; CHIPS_PART_NAME: RES; CDS_PART_NAME: RES_0201-C80792-009,CHIP,0,5%,1/20W,LPDB,GENERIC; CDS_LOCATION: R27180
R28058 = RES: CDS_PHYS_PART_NAME: RES_0402-G21497-014,CHIP,10K,5%,1/16W,LPDB,GENERIC; OriginalSymbolOrigin: (-25,75); XY: (-9325,-1175); VER: 2; SUB_ROOM_2: PUPD; SUB_ROOM_1: POWER SEQUENCING; SUB_ROOM: POWER_SEQUENCING; ROT: 0; PHYS_PAGE: 186; LOCATION: R28058; IP: GENERIC; FP_TECH: LPDB; DRAWING: @RVP1_ADL_SB_ADP_S_DDR5_SODIMM_2DPC_LIB.H55_DG2_2DPC(SCH_1):PAGE555; CDS_LIB: discrete; PCB Footprint: SMR0402IA; CHIPS_PART_NAME: RES; CDS_PART_NAME: RES_0402-G21497-014,CHIP,10K,5%,1/16W,LPDB,GENERIC; CDS_LOCATION: R28058
R28062 = C_RES#1: PART_NUMBER: C17927-001; CHIPS_PART_NAME: C_RES; CDS_PHYS_PART_NAME: C_RES_0402-C17927-001,RES,0,1%,0.0625W,TK0,GENERIC; CDS_LMAN_SYM_OUTLINE: -50,50,50,-50; FP_TECH: TK0; IP: GENERIC; ROOM: NONE; TOLERANCE: 1%; WATTAGE: 0.0625W; OriginalSymbolOrigin: (-75,25); XY: (-8600,-1475); VER: 1; PHYS_PAGE: 186; LOCATION: R28062; DRAWING: @RVP1_ADL_SB_ADP_S_DDR5_SODIMM_2DPC_LIB.H55_DG2_2DPC(SCH_1):PAGE555; CDS_LIB: c_discrete; VARIANT: ?; PCB Footprint: CTK0_SM0402_1100X550_MA; ROT: 0; CDS_PART_NAME: C_RES_0402-C17927-001,RES,0,1%,0.0625W,TK0,GENERIC; CDS_LOCATION: R28062
R28063 = C_RES#1: PART_NUMBER: C17927-001; CHIPS_PART_NAME: C_RES; CDS_PHYS_PART_NAME: C_RES_0402-C17927-001,RES,0,1%,0.0625W,TK0,GENERIC; CDS_LMAN_SYM_OUTLINE: -50,50,50,-50; FP_TECH: TK0; IP: GENERIC; ROOM: NONE; TOLERANCE: 1%; WATTAGE: 0.0625W; OriginalSymbolOrigin: (-75,25); XY: (-8225,-1525); VER: 1; PHYS_PAGE: 186; LOCATION: R28063; DRAWING: @RVP1_ADL_SB_ADP_S_DDR5_SODIMM_2DPC_LIB.H55_DG2_2DPC(SCH_1):PAGE555; CDS_LIB: c_discrete; VARIANT: ?; PCB Footprint: CTK0_SM0402_1100X550_MA; ROT: 0; CDS_PART_NAME: C_RES_0402-C17927-001,RES,0,1%,0.0625W,TK0,GENERIC; CDS_LOCATION: R28063
SW27000 = C_SW_SPST_PB_4P: CDS_PHYS_PART_NAME: C_SW_SPST_PB_4P_SM-672681-007,IC,C_SW_SPST_PB_4P,TK0,GENERIC; CDS_LMAN_SYM_OUTLINE: -150,200,150,-200; FP_TECH: TK0; IP: GENERIC; PACK_TYPE: SM; ROOM: NONE; OriginalSymbolOrigin: (-175,200); XY: (-10625,725); VER: 1; ROT: 0; PHYS_PAGE: 186; LOCATION: SW27000; DRAWING: @RVP1_ADL_SB_ADP_S_DDR5_SODIMM_2DPC_LIB.H55_DG2_2DPC(SCH_1):PAGE555; CDS_LIB: local; VARIANT: ?; PCB Footprint: CTK0_SSW4_VPS5200_3700_MA_VR; SEC_TYPE: SM; CHIPS_PART_NAME: C_SW_SPST_PB_4P; CDS_PART_NAME: C_SW_SPST_PB_4P_SM-672681-007,IC,C_SW_SPST_PB_4P,TK0,GENERIC; CDS_LOCATION: SW27000